# EAGLE design HV Board rev9 (EAGLE 9.2.2)
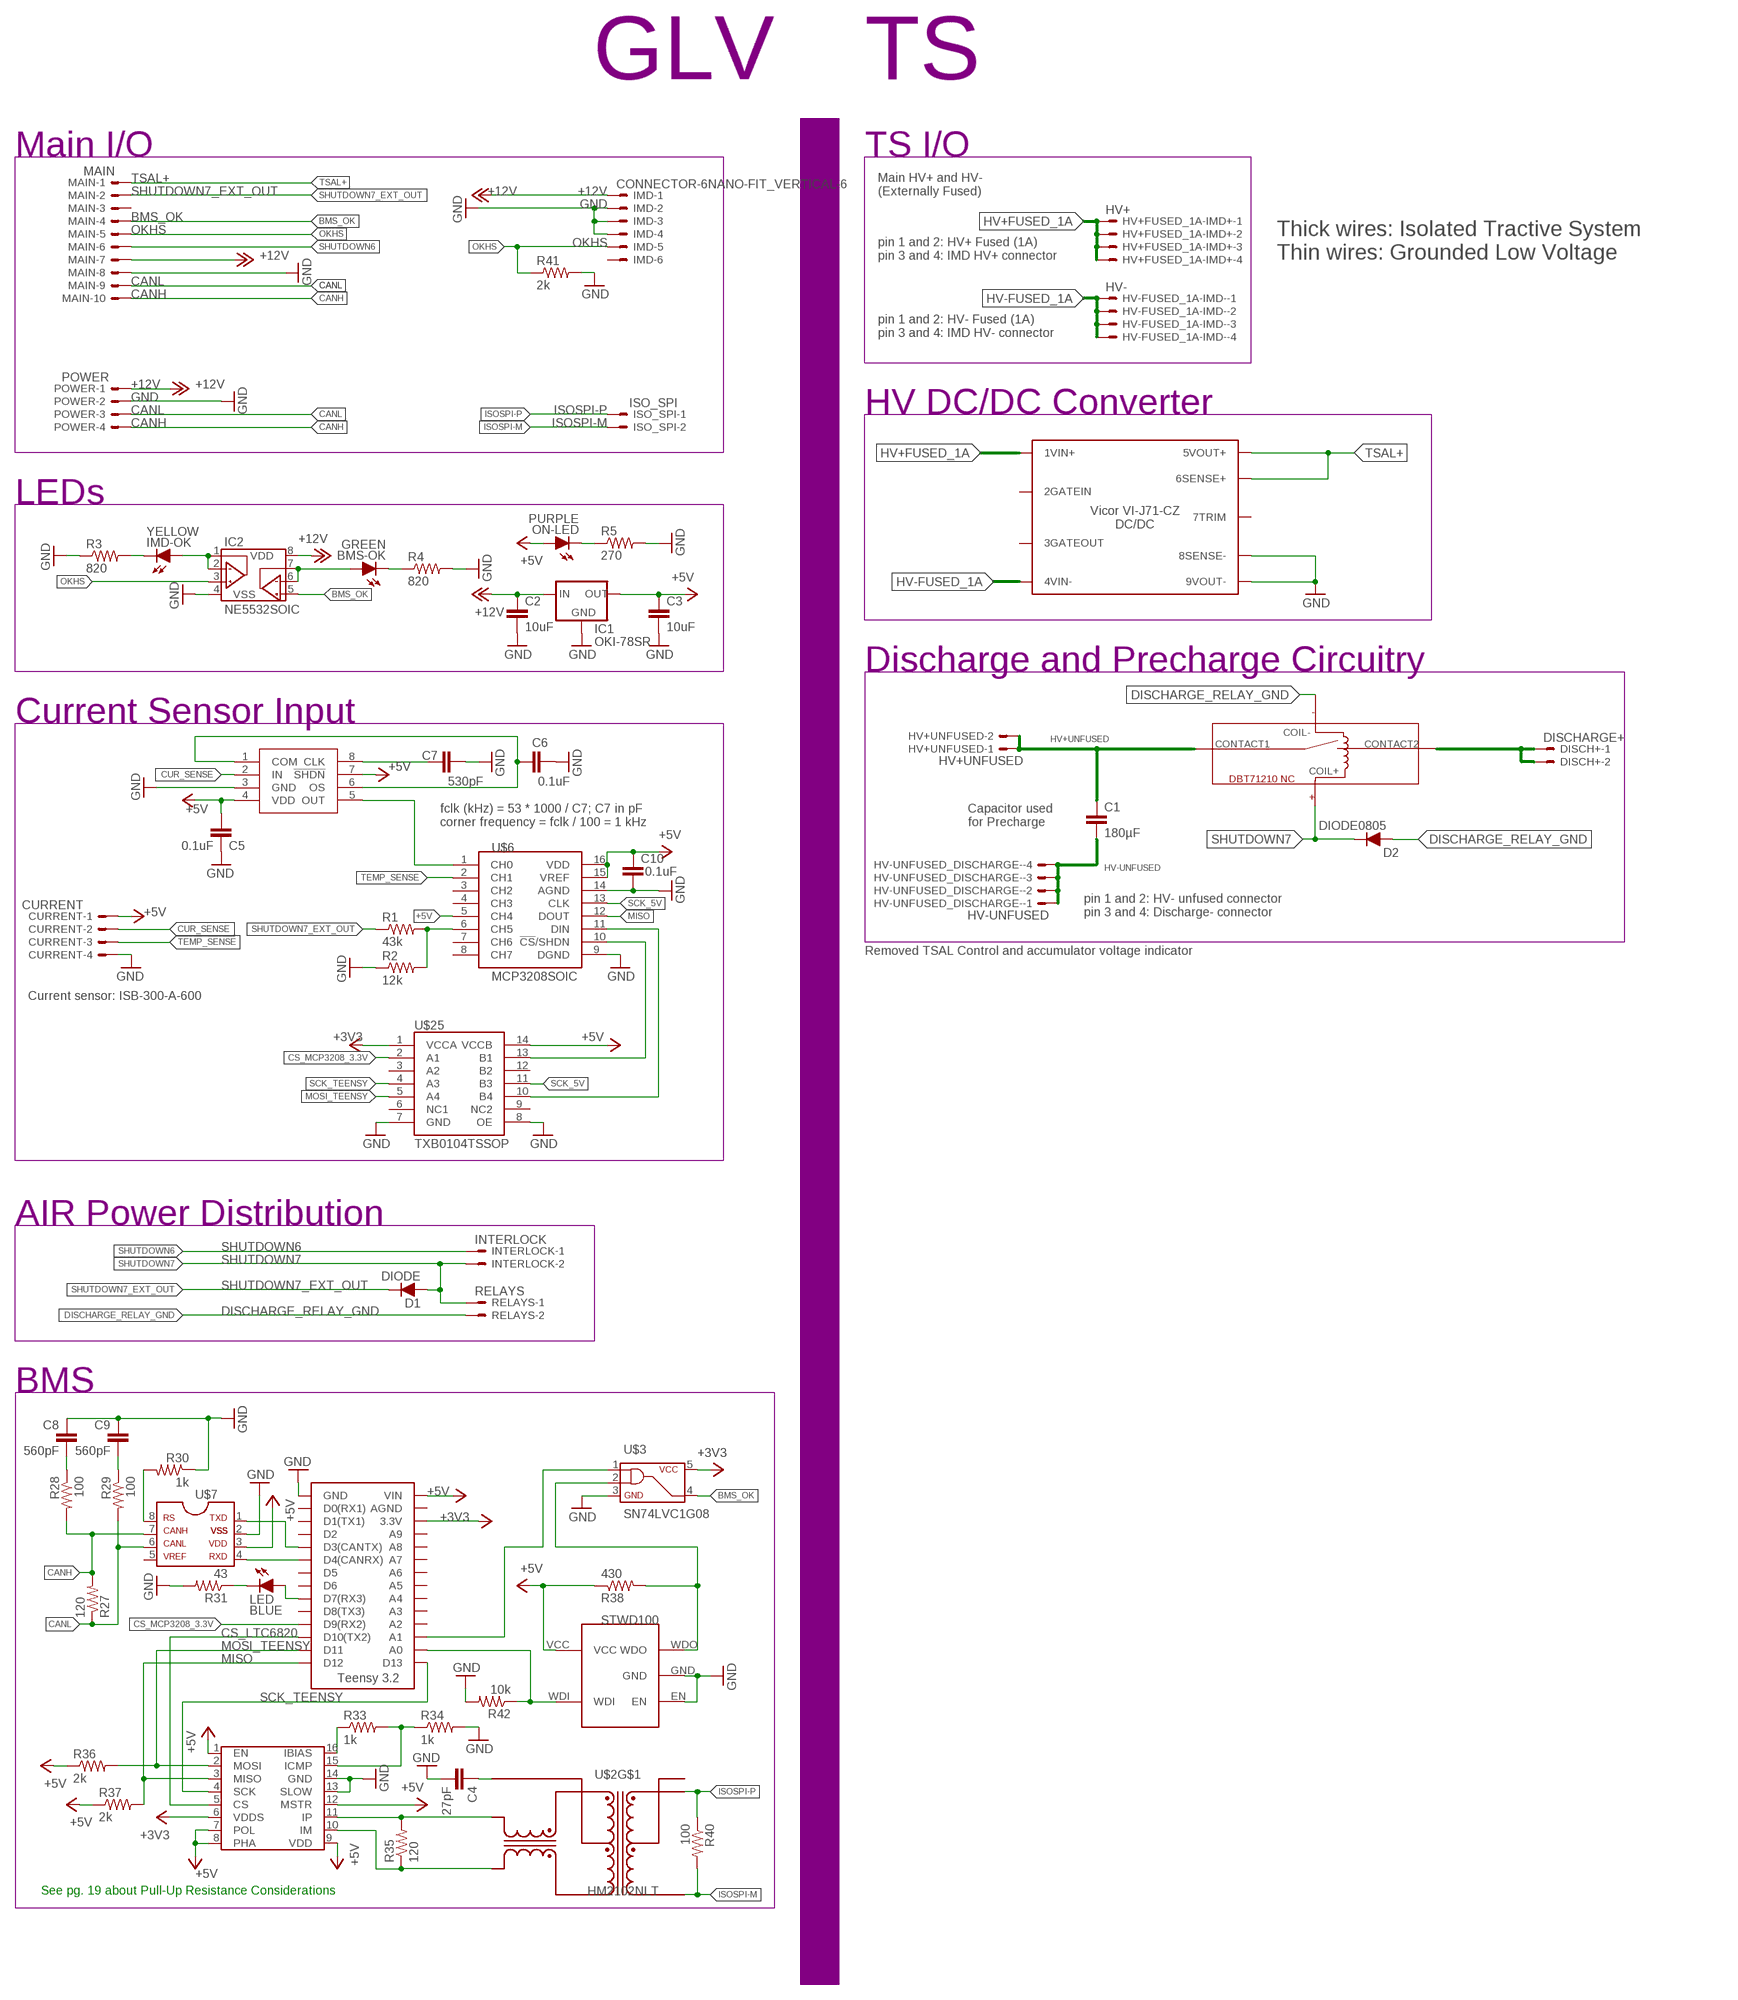
[diagram p0: schematic, sheet 1]

## Parts
BMS-OK  GREEN  LED-0805  [LED-805]
C1  180µF  CAP  [LLS2V221MELZ]
C2  10uF  CAP0805  [0805]
C3  10uF  CAP0805  [0805]
C4  27pF  CAP0805  [0805]
C5  0.1uF  CAP0805  [0805]
C6  0.1uF  CAP0805  [0805]
C7  530pF  CAP0805  [0805]
C8  560pF  CAP0805  [0805]
C9  560pF  CAP0805  [0805]
C10  0.1uF  CAP0805  [0805]
CURRENT  CURRENT  CONNECTOR-4NANO-FIT-VERTICAL-4  [NANO-FIT_VERTICAL-4]
D1  DIODE  DIODEDO-41  [DO-41]
D2  DIODE0805  [0805_D]
DISCH+  DISCHARGE+  CONNECTOR-2NANO-FIT_VERTICAL-2  [NANO-FIT_VERTICAL-2]
HV+FUSED_1A-IMD+  HV+  CONNECTOR-4NANO-FIT-VERTICAL-4  [NANO-FIT_VERTICAL-4]
HV+UNFUSED  HV+UNFUSED  CONNECTOR-2NANO-FIT_VERTICAL-2  [NANO-FIT_VERTICAL-2]
HV-FUSED_1A-IMD-  HV-  CONNECTOR-4NANO-FIT-VERTICAL-4  [NANO-FIT_VERTICAL-4]
HV-UNFUSED_DISCHARGE-  HV-UNFUSED  CONNECTOR-4NANO-FIT-VERTICAL-4  [NANO-FIT_VERTICAL-4]
IC1  OKI-78SR  [OKI-78SR]
IC2  NE5532SOIC  [SOIC-08]
IMD  CONNECTOR-6NANO-FIT_VERTICAL-6  [NANO-FIT_VERTICAL-6]
IMD-OK  YELLOW  LED-0805  [LED-805]
INTERLOCK  INTERLOCK  CONNECTOR-2NANO-FIT_VERTICAL-2  [NANO-FIT_VERTICAL-2]
ISO_SPI  ISO_SPI  CONNECTOR-2NANO-FIT_VERTICAL-2  [NANO-FIT_VERTICAL-2]
LED  BLUE  LED-0805  [LED-805]
MAIN  MAIN  CONNECTOR-10NANO-FIT_VERTICAL-10  [NANO-FIT_VERTICAL-10]
ON-LED  PURPLE  LED-0805  [LED-805]
POWER  POWER  CONNECTOR-4NANO-FIT-VERTICAL-4  [NANO-FIT_VERTICAL-4]
R1  43k  RESISTOR0805-RES  [0805]
R2  12k  RESISTOR0805-RES  [0805]
R3  820  RESISTOR0805-RES  [0805]
R4  820  RESISTOR0805-RES  [0805]
R5  270  RESISTOR0805-RES  [0805]
R27  120  RESISTOR0805-RES  [0805]
R28  100  RESISTOR0805-RES  [0805]
R29  100  RESISTOR0805-RES  [0805]
R30  1k  RESISTOR0805-RES  [0805]
R31  43  RESISTOR0805-RES  [0805]
R33  1k  RESISTOR0805-RES  [0805]
R34  1k  RESISTOR0805-RES  [0805]
R35  120  RESISTOR0805-RES  [0805]
R36  2k  RESISTOR0805-RES  [0805]
R37  2k  RESISTOR0805-RES  [0805]
R38  430  RESISTOR0805-RES  [0805]
R40  100  RESISTOR0805-RES  [0805]
R41  2k  RESISTOR0805-RES  [0805]
R42  10k  RESISTOR0805-RES  [0805]
RELAYS  RELAYS  CONNECTOR-2NANO-FIT_VERTICAL-2  [NANO-FIT_VERTICAL-2]
U$1  MAX7480  [SOIC-08]
U$2  HM2102NLT  [HM2102NLT]
U$3  SN74LVC1G08  [SOT-23-5]
U$4  DBT71210  [DBT71210]
U$5  HV_DCDC_VI-J71-CZ  [HV_DCDC_VI-J71-CZ]
U$6  MCP3208SOIC  [SOIC-16]
U$7  MCP2551  [SOIC-08]
U$8  LTC6820  [MSOP-16]
U$9  TEENSY_3.2_SIMPLE  [TEENSY_3.2_SIMPLE]
U$10  STWD100  [SOT23-5]
U$25  TXB0104TSSOP  [TSSOP-14]

## Nets
+3V3: U$3.5 U$8.6(VDDS) U$9.3.3V U$25.1(VCCA)
+5V: C3.1 C5.1 C10.1 CURRENT.P$1 IC1.3(OUT) ON-LED.A R36.1 R37.1 R38.1 U$1.4(VDD) U$1.7(!SHDN) U$6.5(CH4) U$6.15(VREF) U$6.16(VDD) U$7.3 U$8.1(EN) U$8.7(POL) U$8.8(PHA) U$8.9(VDD) U$8.12(MSTR) U$9.VIN U$10.VCC U$25.14(VCCB)
+12V: C2.1 IC1.1(IN) IC2.8(VDD) IMD.P$1 MAIN.P$7 POWER.P$1
BMS_OK: IC2.5(VINB+) MAIN.P$4 U$3.4
CANH: MAIN.P$10 POWER.P$4 R27.2 R28.2 U$7.7
CANL: MAIN.P$9 POWER.P$3 R27.1 R29.2 U$7.6
CS_LTC6820: U$8.5(CS) U$9.D10(TX2)
CS_MCP3208_3.3V: U$9.D9(RX2) U$25.2(A1)
CUR_SENSE: CURRENT.P$2 U$1.2(IN)
DISCHARGE_RELAY_GND: D2.A RELAYS.P$2 U$4.COIL-
GND: C2.2 C3.2 C4.2 C5.2 C6.2 C7.2 C8.1 C9.1 C10.2 CURRENT.P$4 IC1.2(GND) IC2.4(VSS) IMD.P$2 IMD.P$3 IMD.P$4 MAIN.P$8 POWER.P$2 R2.1 R3.1 R4.2 R5.2 R30.1 R31.2 R34.2 R41.2 R42.2 U$1.3(GND) U$3.3 U$5.8SENSE- U$5.9VOUT- U$6.9(DGND) U$6.14(AGND) U$7.2 U$8.13(SLOW) U$8.14(GND) U$9.GND U$10.EN U$10.GND U$25.7(GND) U$25.8(OE)
HV+FUSED_1A [TS]: HV+FUSED_1A-IMD+.P$1 HV+FUSED_1A-IMD+.P$2 HV+FUSED_1A-IMD+.P$3 HV+FUSED_1A-IMD+.P$4 U$5.1VIN+
HV+UNFUSED [TS]: C1.P$1 HV+UNFUSED.P$1 HV+UNFUSED.P$2 U$4.CONTACT1
HV+UNFUSED_FSAE_DISCHARGE [TS]: DISCH+.P$1 DISCH+.P$2 U$4.CONTACT2
HV-FUSED_1A [TS]: HV-FUSED_1A-IMD-.P$1 HV-FUSED_1A-IMD-.P$2 HV-FUSED_1A-IMD-.P$3 HV-FUSED_1A-IMD-.P$4 U$5.4VIN-
HV-UNFUSED [TS]: C1.P$2 HV-UNFUSED_DISCHARGE-.P$1 HV-UNFUSED_DISCHARGE-.P$2 HV-UNFUSED_DISCHARGE-.P$3 HV-UNFUSED_DISCHARGE-.P$4
IM: R35.1 U$2.P$10(TD-) U$8.10(IM)
IP: R35.2 U$2.P$12(TD+) U$8.11(IP)
ISOSPI-M [ISO_SPI]: ISO_SPI.P$2 R40.2 U$2.P$3(MX-)
ISOSPI-P [ISO_SPI]: ISO_SPI.P$1 R40.1 U$2.P$1(MX+)
MISO: R37.2 U$6.12(DOUT) U$8.3(MISO) U$9.D12
MOSI_5V: U$6.11(DIN) U$25.10(B4)
MOSI_TEENSY: R36.2 U$8.2(MOSI) U$9.D11 U$25.5(A4)
N$1: U$1.5(OUT) U$6.1(CH0)
N$2: C6.1 U$1.1(COM) U$1.6(OS)
N$3: ON-LED.C R5.1
N$4: C7.1 U$1.8(CLK)
N$7: U$6.10(!CS!/SHDN) U$25.13(B1)
N$24: R1.2 R2.2 U$6.6(CH5)
N$25: U$7.1 U$9.D3(CANTX)
N$26: R30.2 U$7.8
N$27: C8.2 R28.1
N$28: C9.2 R29.1
N$29: LED.C R31.1
N$31: R33.1 U$8.16(IBIAS)
N$32: R33.2 R34.1 U$8.15(ICMP)
N$35: C4.1 U$2.P$11(TCT)
N$36: U$7.4 U$9.D4(CANRX)
N$37: LED.A U$9.D7(RX3)
N$38: R38.2 U$3.2 U$10.WDO
N$40: U$3.1 U$9.A1
N$42: IC2.1(VOUTA) IC2.2(VINA-) IMD-OK.A
N$43: BMS-OK.A IC2.6(VINB-) IC2.7(VOUTB)
N$44: BMS-OK.C R4.1
N$45: IMD-OK.C R3.2
N$50: R42.1 U$9.A0 U$10.WDI
OKHS: IC2.3(VINA+) IMD.P$5 MAIN.P$5 R41.1
SCK_5V: U$6.13(CLK) U$25.11(B3)
SCK_TEENSY: U$8.4(SCK) U$9.D13 U$25.4(A3)
SHUTDOWN6: INTERLOCK.P$1 MAIN.P$6
SHUTDOWN7: D1.A D2.C INTERLOCK.P$2 RELAYS.P$1 U$4.COIL+
SHUTDOWN7_EXT_OUT: D1.C MAIN.P$2 R1.1
TEMP_SENSE: CURRENT.P$3 U$6.2(CH1)
TSAL+: MAIN.P$1 U$5.5VOUT+ U$5.6SENSE+
Unconnected: IMD.P$6 MAIN.P$3 U$2.P$2(MCT) U$2.P$4(MX+) U$2.P$5(MCT) U$2.P$6(MX-) U$2.P$7(TD-) U$2.P$8(TCT) U$2.P$9(TD+) U$5.2GATEIN U$5.3GATEOUT U$5.7TRIM U$6.3(CH2) U$6.4(CH3) U$6.7(CH6) U$6.8(CH7) U$7.5 U$9.A2 U$9.A3 U$9.A4 U$9.A5 U$9.A6 U$9.A7 U$9.A8 U$9.A9 U$9.AGND U$9.D0(RX1) U$9.D1(TX1) U$9.D2 U$9.D5 U$9.D6 U$9.D8(TX3) U$25.3(A2) U$25.6(NC1) U$25.9(NC2) U$25.12(B2)

## Notes on the sheet
- GLV
- TS
- Main I/O | TS I/O
- Main HV+ and HV-
  (Externally Fused)
- pin 1 and 2: HV+ Fused (1A)
  pin 3 and 4: IMD HV+ connector
- Thick wires: Isolated Tractive System
  Thin wires: Grounded Low Voltage
- pin 1 and 2: HV- Fused (1A)
  pin 3 and 4: IMD HV- connector
- HV DC/DC Converter
- LEDs
- Discharge and Precharge Circuitry
- Current Sensor Input
- fclk (kHz) = 53 * 1000 / C7; C7 in pF
  corner frequency = fclk / 100 = 1 kHz
- Capacitor used
  for Precharge
- pin 1 and 2: HV- unfused connector
  pin 3 and 4: Discharge- connector
- Removed TSAL Control and accumulator voltage indicator
- Current sensor: ISB-300-A-600
- AIR Power Distribution
- BMS
- See pg. 19 about Pull-Up Resistance Considerations

## Library data of the parts
BMS-OK IMD-OK LED ON-LED = HyTechDevices:LED: Light Emitting Diode (LED) Source: Dangerous Prototypes Eagle Library <https://github.com/DangerousPrototypes/Eagle_Part_Library>
C1-C10 = HyTechDevices:CAP: Capacitor Standard 0603 ceramic capacitor, and 0.1" leaded capacitor.
CURRENT HV+FUSED_1A-IMD+ HV-FUSED_1A-IMD- HV-UNFUSED_DISCHARGE- POWER = HyTechDevices:CONNECTOR-4: Mini-Fit Junior connector 4 pole Source: http://www.molex.com
D1 D2 = HyTechDevices:DIODE: DIODE general purpose rectifier
DISCH+ HV+UNFUSED INTERLOCK ISO_SPI RELAYS = HyTechDevices:CONNECTOR-2: Mini-Fit Junior connector 2 pole Source: http://www.molex.com
IC1 = HyTechDevices:OKI-78SR: Murata OKI-78SR Non-Isolated Switching Regulator DC/DC - Datasheet <https://power.murata.com/data/power/oki-78sr.pdf>
IC2 = HyTechDevices:NE5532: TI NE5532 Dual Channel Op Amp
IMD = HyTechDevices:CONNECTOR-6: Mini-Fit Junior connector 6 pole Source: http://www.molex.com
MAIN = HyTechDevices:CONNECTOR-10: Mini-Fit Junior connector 10 pole Source: http://www.molex.com
R1-R5 R27-R31 R33-R38 R40-R42 = HyTechDevices:RESISTOR: Resistor Basic schematic elements and footprints for 0603, 1206, and PTH resistors.
U$1 = HyTechDevices:MAX7480: 8th-order lowpass butterworth filter
U$2 = HyTechDevices:HM2102NLT: 2 Channel SMT Transformer Turns ratio: 1CT: 1CT Isolation Voltage: 4300 VDC Inductance: 150 uH Leakage Inductance: 0.50 uH max DataSheet <https://www.mouser.com/datasheet/2/336/HM2102NL-1218600.pdf>
U$3 = HyTechDevices:SN74LVC1G08: TI SN74LVC1G08 SINGLE 2-INPUT POSITIVE-AND GATE Datasheet <http://www.ti.com/lit/ds/sces556f/sces556f.pdf>
U$4 = HyTechDevices:DBT71210: DBT71210 Reed Relay Form B (Standard normally closed), switch 12V
U$5 = HyTechDevices:HV_DCDC_VI-J71-CZ: Vicor-Corporation VI-J71-CZ Product Page <https://www.digikey.com/product-detail/en/vicor-corporation/VI-J71-CZ/1102-1486-ND/2996194> Datasheet <http://cdn.vicorpower.com/documents/datasheets/ds_vi-j00.pdf>
U$6 = HyTechDevices:MCP3208: Analog to Digital Converter
U$7 = HyTechDevices:MCP2551: MCP2551 High-Speed CAN Transceiver Product Webpage <https://www.microchip.com/wwwproducts/en/MCP2551> Datasheet <http://ww1.microchip.com/downloads/en/DeviceDoc/21667f.pdf> This device is outdated It is replaced by MCP2561. Comparison Page <https://www.microchip.com/wwwproducts/ProductCompare/MCP2551/MCP2561> Product Webpage <https://www.microchip.com/wwwproducts/en/MCP2561> Datasheet <http://ww1.microchip.com/downloads/en/DeviceDoc/20005167C.pdf>
U$8 = HyTechDevices:LTC6820: Linear Technology isoSPI Isolated Communications Interface Datasheet <http://cds.linear.com/docs/en/datasheet/6820fb.pdf>
U$9 = HyTechDevices:TEENSY_3.2_SIMPLE: Simple version of the Teensy 3.2 board that only uses the 2 main rows of pins, not the inner pins or the pins opposite the usb port.
U$10 = HyTechDevices:STWD100: STWD100 Watchdog timer
U$25 = HyTechDevices:TXB0104: Texas Instruments TXB0104 4-channel low voltage to high voltage Logic Level Shifter. Minimum input voltage level 1.8V. Maximum output voltage level 5.5V.

## Net classes
1 TS: clearance 8.5 mm to class 0
2 ISO_SPI: clearance 8.5 mm to class 0, clearance 8.5 mm to class 1

## Board
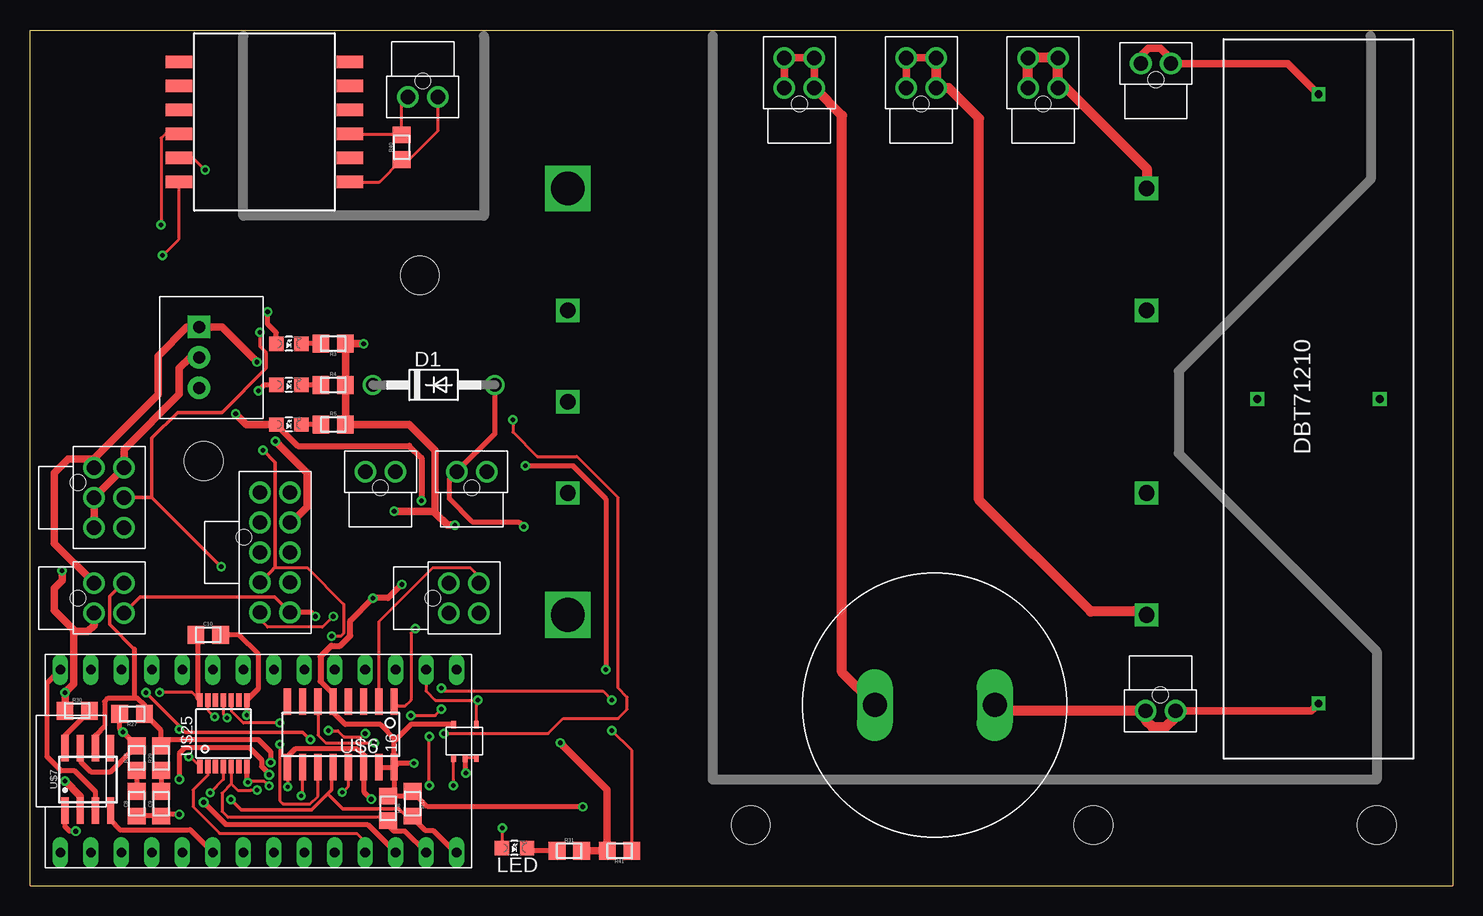
[diagram p1: board, top side]
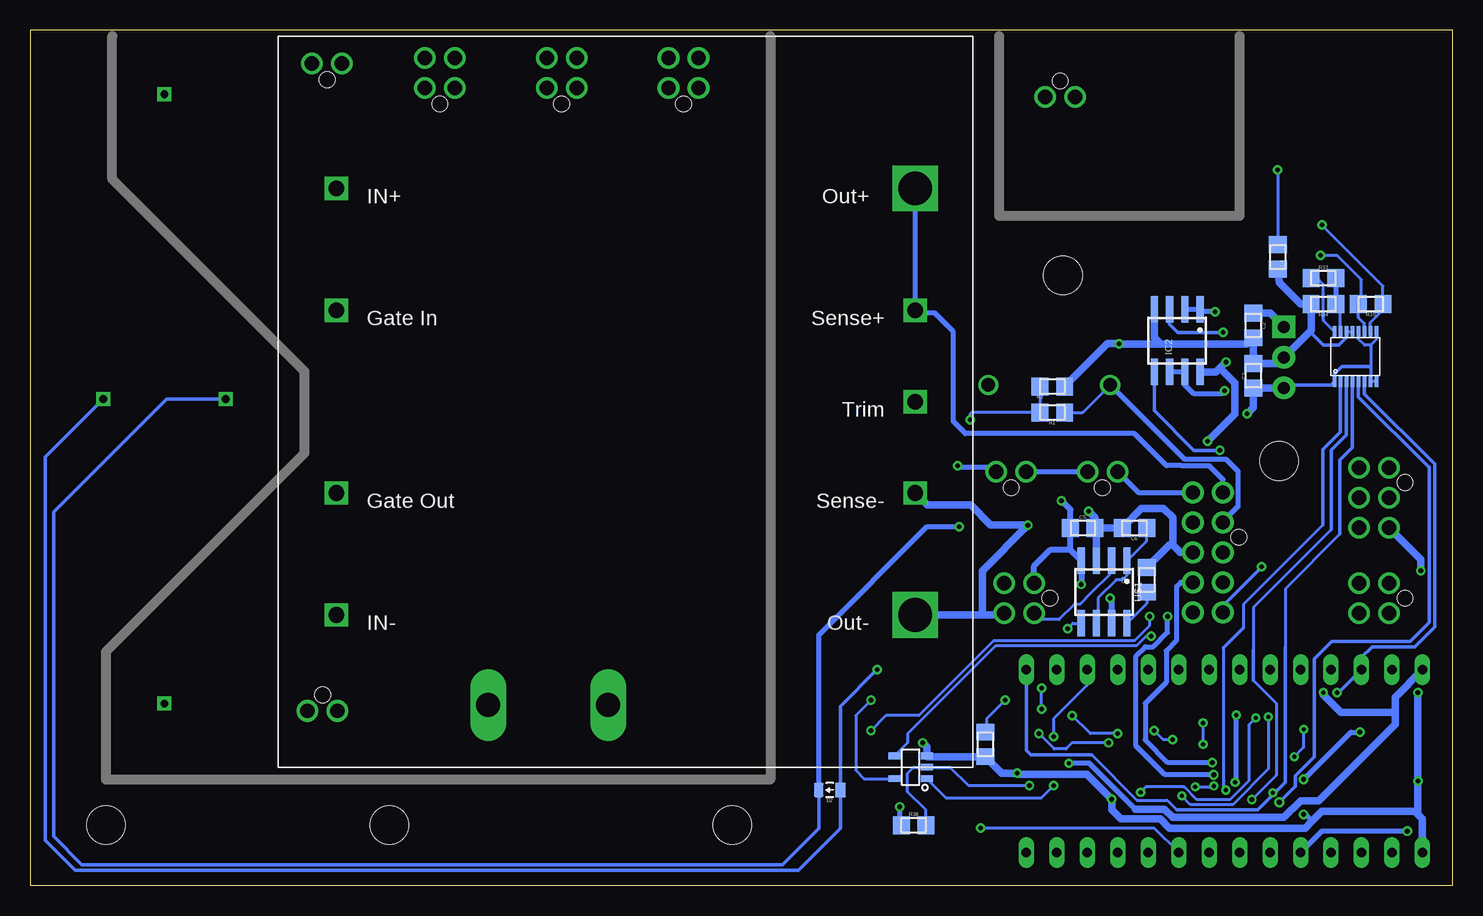
[diagram p2: board, bottom side, seen from below]

Size 118.62 x 71.37 mm. Coordinates in mm from the lower left corner, seen from the top.
Outline: 0,0 118.62,0 118.62,71.37 0,71.37 0,0
Copper layers (1*16): Top 0.035mm / dielectric 1.5mm / Bottom 0.035mm
Design rules "DRC Advanced Circuits": minimum track width 6mil, minimum drill 10mil, track to track 6mil, track to pad 6mil, pad to pad 6mil, via to via 6mil, smd to smd 6mil, copper to edge 40mil, drill to drill 6mil, minimum pad ring 10mil, minimum via ring 8mil, stop-mask expansion 4mil, vias tented up to drill 0mil, thermal gap 10mil
Holes 3.2 mm at 88.65,5.08 14.48,35.43 112.27,5.08 60.07,5.08 32.51,50.93

### Footprints (pad centres in the part's own frame; a part is rotated, then mirrored left to right if it is on the bottom)
LED-805 = smd 1.2 x 1.2: A 0,-1.05; C 0,1.05
LLS2V221MELZ = drill 2 long: P$1 -5,0; P$2 5,0
0805 = smd 1.4 x 1.5: 1 -1.025,0; 2 1.025,0
NANO-FIT_VERTICAL-4 = drill 1.2: P$1 -1.25,0; P$2 1.25,0; P$3 -1.25,2.5; P$4 1.25,2.5 | hole 1.3: 0,-1.34
DO-41 = drill 1.118: A 5.08,0; C -5.08,0
0805_D = smd 0.8 x 1.2: A -0.9,0; C 0.9,0
NANO-FIT_VERTICAL-2 = drill 1.2: P$1 -1.25,0; P$2 1.25,0 | hole 1.3: 0,-1.34
OKI-78SR = drill 1 pad 1.88 square: 1 -2.54,0 | drill 1 pad 1.88: 2 0,0; 3 2.54,0
SOIC-08 = smd 0.6 x 2.2: 1 -1.905,-2.6; 2 -0.635,-2.6; 3 0.635,-2.6; 4 1.905,-2.6; 5 1.905,2.6; 6 0.635,2.6; 7 -0.635,2.6; 8 -1.905,2.6
NANO-FIT_VERTICAL-6 = drill 1.2: P$1 -2.5,0; P$2 0,0; P$3 2.5,0; P$4 -2.5,2.5; P$5 0,2.5; P$6 2.5,2.5 | hole 1.3: -1.25,-1.34
NANO-FIT_VERTICAL-10 = drill 1.2: P$1 -5,0; P$2 -2.5,0; P$3 0,0; P$4 2.5,0; P$5 5,0; P$6 -5,2.5; P$7 -2.5,2.5; P$8 0,2.5; P$9 2.5,2.5; P$10 5,2.5 | hole 1.3: -1.27,-1.34
HM2102NLT = smd 1.067 x 2.184: P$1 0,0; P$2 2,0; P$3 4,0; P$4 6,0; P$5 8,0; P$6 10,0; P$7 10,14.25; P$8 8,14.25; P$9 6,14.25; P$10 4,14.25; P$11 2,14.25; P$12 0,14.25
SOT-23-5 = smd 1 x 0.55: 1 -1.35,0.95; 2 -1.35,0; 3 -1.35,-0.95; 4 1.35,-0.95; 5 1.35,0.95
DBT71210 = drill 0.65 square: COIL+ 30,-13; COIL- 30,-2.8; CONTACT1 55.4,-7.9; CONTACT2 4.6,-7.9
HV_DCDC_VI-J71-CZ = drill 1.3 square: 1VIN+ 5.08,-12.7; 2GATEIN 5.08,-22.86; 3GATEOUT 5.08,-38.1; 4VIN- 5.08,-48.26; 6SENSE+ 53.34,-22.86; 7TRIM 53.34,-30.48; 8SENSE- 53.34,-38.1 | drill 2.8 square: 5VOUT+ 53.34,-12.7; 9VOUT- 53.34,-48.26
SOIC-16 = smd 0.6 x 2.2: 1 -4.445,-2.794; 2 -3.175,-2.794; 3 -1.905,-2.794; 4 -0.635,-2.794; 5 0.635,-2.794; 6 1.905,-2.794; 7 3.175,-2.794; 8 4.445,-2.794; 9 4.445,2.667; 10 3.175,2.667; 11 1.905,2.667; 12 0.635,2.667; 13 -0.635,2.667; 14 -1.905,2.667; 15 -3.175,2.667; 16 -4.445,2.667
MSOP-16 = smd 0.305 x 0.889: 1 -0.1,-0.5; 2 0.4,-0.5; 3 0.9,-0.5; 4 1.4,-0.5; 5 1.9,-0.5; 6 2.4,-0.5; 7 2.9,-0.5; 8 3.4,-0.5; 9 3.4,3.7; 10 2.9,3.7; 11 2.4,3.7; 12 1.9,3.7; 13 1.4,3.7; 14 0.9,3.7; 15 0.4,3.7; 16 -0.1,3.7
TEENSY_3.2_SIMPLE = drill 0.8 long: 3.3V 16.51,29.21; A0 16.51,3.81; A1 16.51,6.35; A2 16.51,8.89; A3 16.51,11.43; A4 16.51,13.97; A5 16.51,16.51; A6 16.51,19.05; A7 16.51,21.59; A8 16.51,24.13; A9 16.51,26.67; AGND 16.51,31.75; D0(RX1) 1.27,31.75; D1(TX1) 1.27,29.21; D2 1.27,26.67; D3(CANTX) 1.27,24.13; D4(CANRX) 1.27,21.59; D5 1.27,19.05; D6 1.27,16.51; D7(RX3) 1.27,13.97; D8(TX3) 1.27,11.43; D9(RX2) 1.27,8.89; D10(TX2) 1.27,6.35; D11 1.27,3.81; D12 1.27,1.27; D13 16.51,1.27; GND 1.27,34.29; VIN 16.51,34.29
SOT23-5 = smd 0.61 x 0.406: EN -2.794,0; GND -2.794,0.94; VCC 0,1.905; WDI 0,0; WDO -2.794,1.905
TSSOP-14 = smd 0.45 x 1.1: 1 -1.958,-2.618; 2 -1.308,-2.618; 3 -0.657,-2.618; 4 -0.007,-2.618; 5 0.642,-2.618; 6 1.292,-2.618; 7 1.942,-2.618; 8 1.942,2.918; 9 1.292,2.918; 10 0.642,2.918; 11 -0.007,2.918; 12 -0.657,2.918; 13 -1.308,2.918; 14 -1.958,2.918

### Placement (x,y rotation side)
BMS-OK  21.59,41.78 270 top
C1  75.43,15.1 180 top
C2  16.64,46.74 270 bottom
C3  16.64,42.55 90 bottom
C4  14.61,52.45 270 bottom
C5  30.86,29.84 0 bottom
C6  26.54,29.84 180 bottom
C7  25.53,25.53 90 bottom
C8  8.89,6.86 90 top
C9  10.92,6.86 90 top
C10  14.86,20.95 0 top
CURRENT  34.92,24 270 top
D1  33.66,41.78 0 top
D2  51.96,8 180 bottom
DISCH+  93.85,68.58 0 top
HV+FUSED_1A-IMD+  84.45,66.55 0 top
HV+UNFUSED  94.23,14.61 180 top
HV-FUSED_1A-IMD-  74.3,66.55 0 top
HV-UNFUSED_DISCHARGE-  64.14,66.55 0 top
IC1  14.1,44.07 270 top
IC2  22.99,45.47 180 bottom
IMD  5.33,32.38 270 top
IMD-OK  21.59,45.21 270 top
INTERLOCK  29.21,34.54 0 top
ISO_SPI  32.75,65.79 180 top
LED  40.39,3.17 270 top
MAIN  19.18,27.81 270 top
ON-LED  21.59,38.48 270 top
POWER  5.33,24 270 top
R1  33.4,39.5 180 bottom
R2  33.4,41.66 180 bottom
R3  25.27,45.21 180 top
R4  25.27,41.78 0 top
R5  25.27,38.48 0 top
R27  8.51,14.35 180 top
R28  8.89,10.67 90 top
R29  10.92,10.67 90 top
R30  3.94,14.61 0 top
R31  44.96,2.92 0 top
R33  10.79,50.67 0 bottom
R34  10.79,48.51 180 bottom
R35  6.86,48.51 180 bottom
R36  29.84,6.48 270 top
R37  31.88,6.86 270 top
R38  44.96,5.08 0 bottom
R40  30.99,61.59 90 top
R41  49.15,2.92 180 top
R42  38.99,11.81 270 bottom
RELAYS  36.83,34.54 0 top
U$1  29.08,24.51 180 bottom
U$2  26.67,58.71 90 top
U$3  45.21,9.91 180 bottom
U$4  115.32,70.61 270 top
U$5  98.17,70.87 0 bottom
U$6  25.91,12.57 180 top
U$7  4.83,8.89 0 top
U$8  9.78,42.55 0 bottom
U$9  36.83,1.52 90 top
U$10  37.21,13.46 90 top
U$25  16.13,12.57 0 top

### Tracks (layer width: path | path; a pad name or v marks a point on that pad's centre or on a via)
+3V3  (via drill 0.35, 0.38)
  Top 0.254: v24.89,12.95 25.65,12.95 26.16,12.45 27.67,12.45 v27.94,12.71 | v31.75,14.22 33.78,14.22 v34.29,14.73 | v34.29,16.51 34.54,16.26 47.75,16.26 v48.51,15.49 | U$25.1 13.34,10.78 v13.22,10.78 | 12.57,13.21 12.57,13.18 v12.44,13.06
  Top 0.305: v9.65,16.13 12.57,13.21 12.95,12.83 22.73,12.83 v23.37,12.19
  Bottom 0.254: v23.37,12.19 24.13,12.19 v24.89,12.95 | v27.94,12.71 30.24,12.71 v31.75,14.22 | v34.29,14.73 v34.29,16.51 | v48.51,15.49 49.78,14.22 49.78,9.65 49.09,8.96 U$3.5 | v13.22,10.78 12.46,11.55 12.46,12.41 12.44,12.42 v12.44,13.06
  Bottom 0.305: U$8.6 7.38,41.03 1.52,35.18 1.52,21.59 3.17,19.94 6.73,19.94 7.62,19.05 U$9.3.3V 9.53,16.13 v9.65,16.13
+5V  (via drill 0.35, 0.38)
  Top 0.254: U$25.14 13.53,16.13 v10.79,16.13
  Top 0.406: U$7.3 5.46,7.87 3.74,9.59 2.6,9.59 1.4,10.79 1.4,16.89 U$9.VIN | U$10.VCC 31.75,13.46 30.48,12.19 | 30.48,12.19 29.21,13.46 26.29,13.46 25.27,14.48 U$6.5 25.27,16.01 24.21,17.07 | v46.1,6.6 33.16,6.6 R37.1 31.5,7.5 R36.1 30.35,8.01 U$6.16 | C10.1 13.96,20.83 13.96,15.7 U$25.14 | U$6.15 U$6.16 | U$6.16 30.35,12.06 30.48,12.19 | v32,10.23 30.68,10.23 U$6.16
  Top 0.508: ON-LED.A 22.32,36.7 31.62,36.7 32.64,35.69 v32.64,32.13 | v30.99,25.15 29.84,24 v28.57,24 26.7,22.12 26.7,20.86 25.86,20.03 25.11,20.03 24.21,19.13 24.21,17.07
  Top 0.61: v17.14,39.37 18.03,38.48 ON-LED.A
  Bottom 0.254: U$8.8 U$8.7 6.86,42.07 6.86,43.18 6.86,45.09 | 28.45,23.88 v28.57,24 | U$8.9 6.38,45.56 6.86,45.09 | 6.86,45.09 7.37,45.09 7.88,45.6 U$8.12
  Bottom 0.305: IC1.3 13.85,41.77 10.15,41.77 U$8.1 9.88,42.7 9.27,43.31 6.99,43.31 6.86,43.18
  Bottom 0.406: R38.1 46.1,5.2 v46.1,6.6 | 26.48,6.41 30.3,10.23 v32,10.23
  Bottom 0.508: v32.64,32.13 31.89,31.38 C5.1 31.89,28.01 | 31.89,28.01 U$1.4 v30.99,25.15 | 31.89,28.01 33.59,28.01 34.92,26.67 CURRENT.P$1 | U$1.7 28.45,23.88
  Bottom 0.61: 26.48,6.41 24.07,6.41 23.37,5.71 14.1,5.71 12.7,7.11 11.18,7.11 4.83,13.46 4.83,14.48 | 4.83,14.48 4.83,15.75 U$9.VIN | IC1.3 C3.1 16.64,39.88 v17.14,39.37 | v10.79,16.13 10.79,15.94 9.33,14.48 4.83,14.48
+12V  (via drill 0.38)
  Top 0.61: v20.45,37.08 23.11,34.42 23.11,31.62 21.8,30.31 MAIN.P$7 | 5.29,35.61 10.67,40.98 10.67,44.2 13.08,46.61 IC1.1 16,46.61 v18.92,43.69 | 5.29,35.61 3.18,35.61 2.02,34.45 2.02,32.82 2.03,32.81 2.03,28.55 POWER.P$1 | IMD.P$1 5.29,34.93 5.29,35.61
  Bottom 0.61: C2.1 16.63,47.75 15.24,47.75 IC1.1 | IC2.8 19.75,42.87 19.43,43.18 | 19.43,43.18 v18.92,43.69 | 19.43,43.18 18.16,41.92 18.16,39.37 v20.45,37.08
BMS_OK  (via drill 0.38)
  Top 0.254: 20.11,26.25 20.41,26.54 23.11,26.54 26.16,23.5 26.16,21.08 25.91,20.83 v25.15,20.83
  Top 0.305: MAIN.P$4 20.11,26.25 20.45,26.58 20.45,35.33 v19.43,36.34
  Bottom 0.254: v25.15,20.83 25.59,20.83 26.38,20.04 38.12,20.04 45.47,12.7 45.47,11.95 U$3.4
  Bottom 0.305: IC2.5 24.89,39.62 21.59,36.32 19.45,36.32 v19.43,36.34
CANH  (via drill 0.38, 0.4)
  Top 0.305: POWER.P$4 9.19,24.11 20.38,24.11 MAIN.P$10
  Top 0.406: R27.2 7.48,13.1 v7.75,12.83 R28.2 7.62,10.42 7.62,10.41 6.73,9.53 5.08,9.53 4.19,10.41 U$7.7 | v23.79,22.48 23.45,22.81 MAIN.P$10 | v12.45,8.89 12.45,11.05 12.95,11.56 18.29,11.56 19.31,10.54 19.31,9.97 19.94,9.34 v19.94,9.27
  Bottom 0.406: v12.45,8.89 8.51,12.83 v7.75,12.83 | v19.94,9.27 24,9.27 26.42,11.68 26.42,19.18 25.65,19.94 24.98,19.94 23.79,21.13 v23.79,22.48
CANL  (via drill 0.4)
  Top 0.254: 11.05,12.2 11.05,11.82 R29.2
  Top 0.305: POWER.P$3 7.73,25.25 6.63,24.16 6.63,21.82 8.7,19.75
  Top 0.406: U$7.6 5.46,12.57 6.22,13.34 6.22,15.37 6.54,15.68 8.76,15.68 | 8.76,15.68 8.95,15.68 9.59,15.04 9.59,14.29 | 11.05,12.2 19.04,12.2 20.07,11.17 v20.07,10.28 | R29.2 10.92,12.96 9.59,14.29 | 9.59,14.29 R27.1 | 8.7,19.75 8.7,15.75 8.76,15.68
  Bottom 0.406: v20.07,10.28 23.75,10.28 25.65,12.19 25.65,15.24 23.91,16.99 23.91,19.62 23.04,20.48 23.04,24.97 22.69,25.31 MAIN.P$9
CS_LTC6820  (via drill 0.4)
  Top 0.406: v14.48,6.99 16.32,5.14 28.13,5.14 U$9.D10(TX2)
  Bottom 0.305: v14.48,6.99 13.15,8.31 13.15,9.18 11.56,10.78 11.56,18.92 10.08,20.4 3.56,20.4 1.98,21.97 1.98,34.92 2.03,34.92 7.88,40.77 U$8.5
CS_MCP3208_3.3V
  Top 0.254: U$25.2 14.82,9.23 13.59,8 13.59,6.6 15.81,4.38 27.24,4.38 27.94,3.68 U$9.D9(RX2)
CUR_SENSE
  Bottom 0.254: U$1.2 28.57,26.98 28.57,26.04 30.1,24.51 31.11,23.5 31.56,23.5 32.84,22.21 34.33,22.21 34.87,22.75 CURRENT.P$2
DISCHARGE_RELAY_GND  (via drill 0.38)
  Top 0.406: v41.27,35.05 45.21,35.05 48.01,32.26 v48.01,18.05
  Bottom 0.305: U$4.COIL- 117.35,35.78 117.35,3.81 114.84,1.3 54.87,1.3 54.58,1.3 51.06,4.82 D2.A 51.06,15 v48.01,18.05
  Bottom 0.406: RELAYS.P$2 38.46,34.92 41.15,34.92 v41.27,35.05
GND  (via drill 0.35, 0.38, 0.4)
  Top 0.254: U$10.EN U$10.GND | U$6.9 21.46,8.29 v21.49,8.27 | v19.94,8.34 19.69,8.59 19.66,8.59 19.52,8.73 18.07,8.73
  Top 0.406: C8.1 C9.1 11.06,5.97 v12.45,5.97 | v2.91,16.12 v2.92,16.13 | U$6.9 21.46,10.79 22.1,11.43 27.3,11.43 27.81,10.92 U$6.14 27.81,7.87 v28.45,7.24 | U$10.GND 36.27,9.45 v36.32,9.4 | v18.05,14.25 18.07,14.27 U$25.8 19.05,16.47 19.05,19.3 17.4,20.95 C10.2 | U$25.7 18.07,8.73 v18.16,8.64
  Top 0.61: 33.78,31.37 33.78,31.11 34.8,30.1 v35.43,30.1 | 33.78,31.37 33.78,36.32 31.62,38.48 R5.2 R4.2 R3.1 v27.81,45.21 | v30.35,31.24 33.66,31.24 33.78,31.37 | IMD.P$3 IMD.P$2 IMD.P$4 7.83,36.41 12.45,41.02 12.45,43.18 13.34,44.07 IC1.2 | v2.68,26.29 2.68,25.48 2.02,24.82 2.02,23 3.65,21.37 | 3.65,21.37 3.81,21.21 4.83,21.21 5.33,21.72 POWER.P$2 | 3.65,21.37 3.65,16.86 v2.91,16.12 | v2.92,16.13 2.92,14.61 R30.1 | U$7.2 4.19,7.49 v2.92,8.76 | v44.2,11.94 48.12,8.01 R41.2 R31.2
  Bottom 0.254: U$8.14 U$8.13 | 39.06,10.86 R42.2 | v21.49,8.27 20.01,8.27 v19.94,8.34
  Bottom 0.305: 11.82,46.35 11.82,46.11 10.79,45.09 9.51,45.09 8.88,45.72 U$8.14
  Bottom 0.406: v12.45,5.97 12.32,5.97 11.75,5.4 | v18.16,8.64 18.05,8.74 v18.05,14.25
  Bottom 0.61: 2.92,5.97 3.18,6.22 10.92,6.22 11.75,5.4 12.32,4.83 23.62,4.83 24.38,5.59 27.69,5.59 28.45,6.35 v28.45,7.24 30.5,9.3 36.22,9.3 v36.32,9.4 37.6,9.4 39.06,10.86 | C4.2 14.48,50.29 12.7,48.51 R34.2 11.82,46.35 IC1.2 14.6,43.57 C3.2 C2.2 17.16,45.19 24.36,45.19 | v30.35,31.24 29.84,30.73 C5.2 | U$5.8SENSE- 43.81,31.75 40.2,31.75 38.54,30.1 v35.43,30.1 39.24,26.29 39.24,22.61 | U$5.9VOUT- 39.24,22.61 | 39.24,22.61 37.57,22.61 CURRENT.P$4 | 23.37,28.45 23.37,30.73 24.13,31.5 25.96,31.5 26.68,30.78 26.68,30.74 C6.2 C5.2 | 23.37,28.45 22.73,27.81 MAIN.P$8 | IMD.P$3 2.68,27.23 v2.68,26.29 | v2.92,16.13 v2.92,8.76 2.92,5.97 | R42.2 43.79,10.79 U$3.3 43.86,11.6 v44.2,11.94 | C7.2 23.63,28.45 23.37,28.45 | 2.92,5.97 2.54,5.59 U$9.GND | C5.2 29.72,29.73 U$1.3 | IC2.4 24.89,45.72 24.36,45.19 | 24.36,45.19 27.79,45.19 v27.81,45.21 28.82,45.21 R2.1
HV+FUSED_1A
  Top 0.813: HV+FUSED_1A-IMD+.P$1 HV+FUSED_1A-IMD+.P$3 HV+FUSED_1A-IMD+.P$4 HV+FUSED_1A-IMD+.P$2 86.36,66.55 93.09,59.82 U$5.1VIN+
HV+UNFUSED
  Top 0.61: HV+UNFUSED.P$1 106.81,14.61 U$4.CONTACT1
  Top 0.813: C1.P$1 80.92,14.61 HV+UNFUSED.P$2 92.98,13.82 93.6,13.21 94.61,13.21 95.48,14.08 HV+UNFUSED.P$1
HV+UNFUSED_FSAE_DISCHARGE
  Top 0.61: DISCH+.P$1 92.6,69.23 93.22,69.85 94.23,69.85 95.1,68.98 DISCH+.P$2 104.85,68.58 U$4.CONTACT2
HV-FUSED_1A
  Top 0.61: HV-FUSED_1A-IMD-.P$1 HV-FUSED_1A-IMD-.P$3 HV-FUSED_1A-IMD-.P$4
  Top 0.813: U$5.4VIN- 92.81,22.89 88.43,22.89 79.12,32.19 79.12,64.01 76.58,66.55 HV-FUSED_1A-IMD-.P$2 HV-FUSED_1A-IMD-.P$4
HV-UNFUSED
  Top 0.61: HV-UNFUSED_DISCHARGE-.P$1 HV-UNFUSED_DISCHARGE-.P$3 HV-UNFUSED_DISCHARGE-.P$4 HV-UNFUSED_DISCHARGE-.P$2
  Top 0.813: C1.P$2 67.69,17.83 67.69,64.24 HV-UNFUSED_DISCHARGE-.P$2
IM  (via drill 0.38)
  Top 0.254: v10.92,55.12 10.92,62.36 11.27,62.71 U$2.P$10
  Bottom 0.254: v10.92,55.12 5.83,50.03 R35.1 5.83,48.04 6.88,46.99 U$8.10
IP  (via drill 0.38)
  Top 0.254: v11.05,52.58 12.42,53.95 U$2.P$12
  Bottom 0.254: U$8.11 7.38,46.9 7.88,47.4 R35.2 7.62,48.78 7.62,50.55 9.65,52.58 v11.05,52.58
ISOSPI-M
  Top 0.254: ISO_SPI.P$2 30.99,65.28 R40.2 30.9,62.71 U$2.P$3
ISOSPI-P
  Top 0.254: ISO_SPI.P$1 34.04,65.75 34.04,62.98 31.62,60.57 R40.1 29.12,58.71 U$2.P$1
MISO  (via drill 0.38)
  Top 0.254: R37.2 31.82,5.77 31.81,5.77 | 25.27,9.53 U$6.12
  Top 0.305: 24.83,7.68 23.5,6.35 17.61,6.35 v16.76,7.2 | 24.83,7.68 25.15,8 25.15,9.4 25.27,9.53 | R37.2 31.34,5.83 30.72,6.46 26.05,6.46 24.83,7.68
  Top 0.406: 31.81,5.77 32.95,4.64 33.59,4.64 35.43,2.79 U$9.D12
  Bottom 0.254: 10.13,29.72 16.64,23.21 16.64,19.68 | v16.76,7.2 14.73,9.23 14.73,15.24 16.64,17.14
  Bottom 0.305: U$8.3 8.88,37.59 10.13,36.34 10.13,29.72 | 16.64,19.68 16.64,17.14
MOSI_5V  (via drill 0.35)
  Top 0.254: U$25.10 16.77,14.6 17.78,13.59 v20.83,13.59 | v20.83,11.81 20.83,7.11 21.08,6.86 23.37,6.86 24,7.49 U$6.11
  Bottom 0.254: v20.83,13.59 v20.83,11.81
MOSI_TEENSY  (via drill 0.35)
  Top 0.254: R36.2 29.58,5.71 16.51,5.71 16,6.22 16,7.74 16.77,8.51 | U$25.5 16.77,8.51 | v18.92,8 18.46,8 18.43,7.98 17.3,7.98 16.77,8.51
  Top 0.406: U$9.D11 31.24,4.57 30.35,4.57 29.84,5.08 R36.2
  Bottom 0.254: U$8.2 9.4,42.03 | 10.84,30.1 17.45,23.49 17.45,21.52 | 19.12,19.85 19.12,8.83 19.09,8.8 19.09,8.17 v18.92,8
  Bottom 0.305: 9.4,42.03 9.4,37.84 10.84,36.4 10.84,30.1 | 17.45,21.52 19.12,19.85
N$1  (via drill 0.38)
  Top 0.254: v32.13,21.46 31.75,21.08 31.75,15.49 31.24,14.99 30.73,14.99 U$6.1
  Bottom 0.254: v32.13,21.46 31.68,21.91 U$1.5
N$2
  Bottom 0.254: C6.1 25.52,28.77 U$1.1 27.18,25.91 27.56,25.53 28.07,25.53 29.59,24 29.59,22.04 U$1.6
N$3
  Top 0.406: R5.1 ON-LED.C
N$4
  Bottom 0.254: U$1.8 25.53,23.56 C7.1
N$7  (via drill 0.35)
  Top 0.254: U$25.13 14.82,14.66 v15.39,14.1 | v22.61,7.52 22.73,7.64 U$6.10
  Bottom 0.254: v15.39,14.1 15.39,9.76 18.36,6.78 21.87,6.78 v22.61,7.52
N$24  (via drill 0.38)
  Top 0.254: v28.7,11.94 24.64,11.94 24,12.57 U$6.6 | v34.51,12.71 43.19,12.71 44.45,13.97 49.02,13.97 49.78,14.73 49.78,15.75 49.02,16.51 49.02,32.38 45.59,35.81 42.29,35.81 40.26,37.85 v40.26,38.86
  Bottom 0.254: v28.7,11.94 31.75,11.94 32.26,11.43 33.23,11.43 v34.51,12.71 | v40.26,38.86 40.26,39.37 40.13,39.5 R1.2 R2.2
N$25  (via drill 0.4)
  Top 0.406: U$7.1 2.92,4.95 3.3,4.57 v3.81,4.57
  Bottom 0.406: v3.81,4.57 10.92,4.57 U$9.D3(CANTX)
N$26
  Top 0.406: R30.2 2.92,12.56 U$7.8
N$27
  Top 0.406: R28.1 C8.2
N$28
  Top 0.406: R29.1 C9.2
N$29
  Top 0.406: R31.1 41.69,2.92 LED.C
N$31
  Bottom 0.254: U$8.16 10.79,47.16 10.79,50.16 11.3,50.67 R33.1
N$32
  Bottom 0.254: U$8.15 9.38,48.38 9.77,48.77
  Bottom 0.406: R33.2 9.77,48.77 R34.1
N$35  (via drill 0.38)
  Top 0.254: U$2.P$11 13.59,60.71 v14.61,59.69
  Bottom 0.254: v14.61,59.69 C4.1
N$36
  Top 0.406: U$9.D4(CANRX) 13.34,4.7 7.49,4.7 6.73,5.46 U$7.4
N$37  (via drill 0.38)
  Top 0.254: v39.37,4.83 39.37,3.21 LED.A
  Bottom 0.254: U$9.D7(RX3) 24.89,4.83 v39.37,4.83
N$38  (via drill 0.38)
  Top 0.254: v35.31,8.38 U$10.WDO
  Bottom 0.254: R38.2 43.93,6.34 45.47,7.87 45.47,9.4 44.96,9.91 U$3.2 41.91,9.91 40.39,8.38 v35.31,8.38
N$40  (via drill 0.38)
  Top 0.254: v33.27,8.38 v33.27,12.45
  Bottom 0.254: U$3.1 42.27,7.37 34.29,7.37 v33.27,8.38 | v33.27,12.45 33.27,13.97 30.48,16.76 U$9.A1
N$42  (via drill 0.38)
  Top 0.406: IMD-OK.A 20.54,46.13 19.81,46.86 v19.81,47.88
  Bottom 0.406: v19.81,47.88 20.89,47.88 IC2.1 IC2.2
N$43  (via drill 0.38)
  Top 0.406: BMS-OK.A 19.52,41.78 19.05,41.31 v19.05,41.27
  Bottom 0.406: IC2.6 IC2.7 22.35,41.78 21.59,41.02 19.3,41.02 v19.05,41.27
N$44
  Top 0.406: R4.1 BMS-OK.C
N$45
  Top 0.406: R3.2 IMD-OK.C
N$50  (via drill 0.38)
  Top 0.254: U$10.WDI 37.21,15.37 | 37.21,15.37 v37.34,15.49 | 37.21,15.37 37.08,15.49 33.78,15.49 33.02,16.26 U$9.A0
  Bottom 0.254: R42.1 38.86,12.96 38.86,13.97 v37.34,15.49
OKHS  (via drill 0.38)
  Top 0.254: R41.1 50.17,11.29 v48.51,12.95 | v25.27,22.48 24.38,21.59 19.81,21.59 19.18,22.23 MAIN.P$5
  Top 0.305: IMD.P$5 10.16,32.38 | 10.16,32.38 v15.94,26.61 | 10.16,32.38 10.16,37.34 12.32,39.5 16,39.5 19.68,43.18 19.68,44.44 19.64,44.49 19.64,44.5 19.18,44.96 v19.18,46.16
  Bottom 0.254: v48.51,12.95 47.24,14.22 44.52,14.22 38.29,20.45 26.54,20.45 25.27,21.72 v25.27,22.48 | 23.62,46.86 IC2.3
  Bottom 0.305: v15.94,26.61 19.18,23.37 MAIN.P$5 | v19.18,46.16 22.92,46.16 23.62,46.86
SCK_5V  (via drill 0.35)
  Top 0.254: U$25.11 16.12,14.32 v16.42,14.02 | v26.04,7.81 26.54,8.32 U$6.13
  Bottom 0.254: v16.42,14.02 17.02,13.42 17.02,8.76 18.59,7.19 21.34,7.19 22.4,8.26 25.59,8.26 v26.04,7.81
SCK_TEENSY  (via drill 0.35)
  Top 0.254: U$25.4 16.12,8.88 v15.01,7.77
  Bottom 0.254: 9.42,29.34 13.97,24.79 13.97,19.94 | v15.01,7.77 15.01,7.59 15.05,7.56 | 30.1,10.92 26.33,7.15 23.81,7.15 23.01,6.35
  Bottom 0.305: U$8.4 8.38,36.55 9.42,35.51 9.42,29.34 | 13.97,19.94 13.97,8.64 15.05,7.56 16.26,6.35 23.01,6.35 | 30.1,10.92 35.18,10.92 35.56,11.3 U$9.D13
SHUTDOWN6
  Bottom 0.406: INTERLOCK.P$1 26.23,32.81 MAIN.P$6
SHUTDOWN7  (via drill 0.38)
  Top 0.406: v41.15,29.97 40.77,30.35 36.91,30.35 34.96,32.3 34.96,33.92 RELAYS.P$1 38.73,37.7 D1.A
  Bottom 0.305: U$4.COIL+ 107.22,40.61 116.65,31.18 116.65,4.12 114.3,1.78 55.88,1.78 52.86,4.8 D2.C
  Bottom 0.406: RELAYS.P$1 INTERLOCK.P$2 | D2.C 52.86,20.95 43.84,29.97 v41.15,29.97
SHUTDOWN7_EXT_OUT
  Bottom 0.254: R1.1 30.86,39.5 D1.C
  Bottom 0.406: D1.C 22.39,35.59 18.91,35.59 17.92,34.6 17.92,31.64 19.21,30.35 MAIN.P$2
TEMP_SENSE
  Top 0.254: CURRENT.P$3 37.42,25.82 36.7,26.54 33.59,26.54 29.08,22.04 U$6.2
TSAL+
  Bottom 0.406: MAIN.P$1 19.18,33.91 20.3,35.03 22.62,35.03 22.63,35.05 23.88,35.05 26.54,37.72 40.64,37.72 41.66,38.73 41.66,46.23 43.18,47.75 44.58,47.75 U$5.6SENSE+ U$5.5VOUT+

### Text on the board
tDocu: GLV | GLV | isoSPI | GLV | GLV | 2019_hv_board_rev9 | Designed by Yvonne Yeh | isoSPI | TS | UNFUSED- | FUSED- | FUSED+ | isoSPI | GLV | DISCHARGE- | IMD- | IMD+ | TS | GLV | isoSPI | GLV | GLV | DANGER / HIGH VOLTAGE | TS | GLV | TRACTIVE SYSTEM / PCB AREA | TS | TS | GLV | GLV | IMD | GLV | TS | TS | GLV | TS | UNFUSED+ | GLV | Grounded Low / Voltage PCB Area
bDocu: isoSPI | GLV | GLV | GLV | GLV | TS | TS | GLV | isoSPI | isoSPI | GLV | isoSPI | GLV | GLV | DANGER / HIGH VOLTAGE | TS | GLV | GLV | TS | GLV | TRACTIVE SYSTEM / PCB AREA | TS | GLV | GLV | TS | TS | TS | GLV | Grounded Low / Voltage PCB Area